# Altium schematic sheet POWER.SchDoc
size A4; SheetNumber: 1; SheetTotal: 2
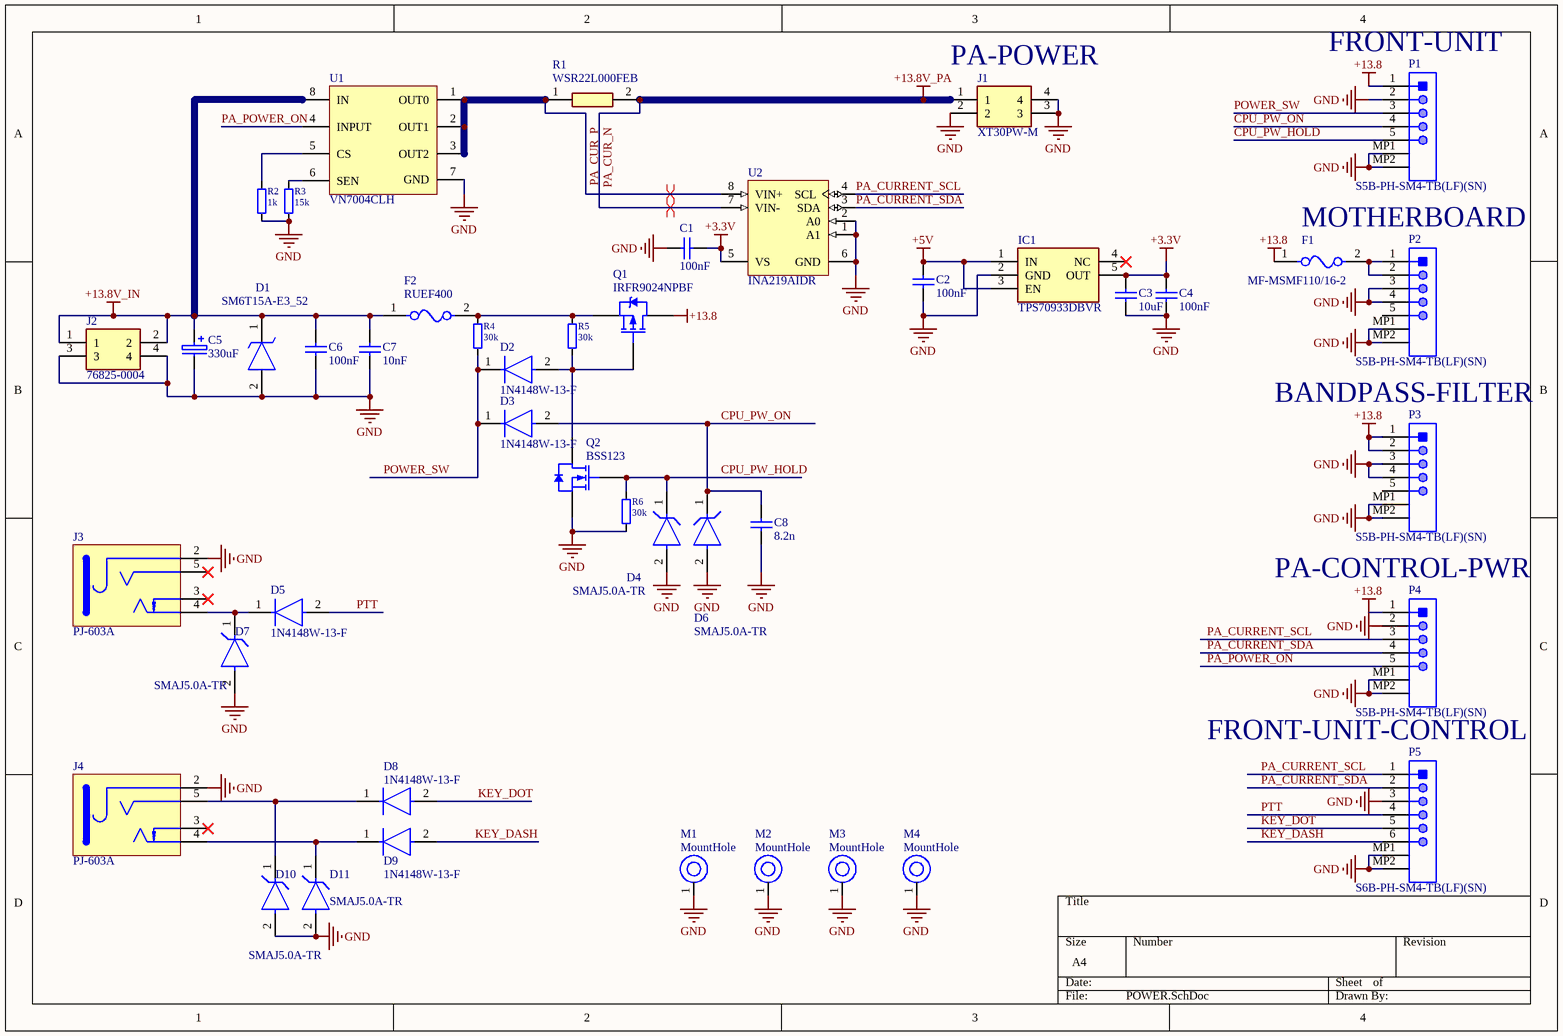
[diagram p0: POWER.SchDoc]

## Parts
C1  100nF  [C-0805]
C2  100nF  [C-0805]
C3  10uF  [C-0805]
C4  100nF  [C-0805]
C5  330uF  [CE 5.0-10x12.5]
C6  100nF  [C-0805]
C7  10nF  [C-0805]
C8  8.2n  [C-0805]
D1  SM6T15A-E3_52  [DIOM5436X244N]
D2  1N4148W-13-F  [FP-SOD123-MFG]
D3  1N4148W-13-F  [FP-SOD123-MFG]
D4  SMAJ5.0A-TR  [FP-SMA-MFG]
D5  1N4148W-13-F  [FP-SOD123-MFG]
D6  SMAJ5.0A-TR  [FP-SMA-MFG]
D7  SMAJ5.0A-TR  [FP-SMA-MFG]
D8  1N4148W-13-F  [FP-SOD123-MFG]
D9  1N4148W-13-F  [FP-SOD123-MFG]
D10  SMAJ5.0A-TR  [FP-SMA-MFG]
D11  SMAJ5.0A-TR  [FP-SMA-MFG]
F1  MF-MSMF110/16-2  [FP-MF-MSMF110-16-MFG]
F2  RUEF400  [FP-RUEF400-MFG]
IC1  TPS70933DBVR  [SOT95P280X145-5N]
J1  XT30PW-M  [XT30PWM]
J2  76825-0004  [768250004]
J3  PJ-603A  [PJ-603A]
J4  PJ-603A  [PJ-603A]
M1  MountHole  [MountHole]
M2  MountHole  [MountHole]
M3  MountHole  [MountHole]
M4  MountHole  [MountHole]
P1  S5B-PH-SM4-TB(LF)(SN)  [JST-S5B-PH-SM4-TB_V]
P2  S5B-PH-SM4-TB(LF)(SN)  [JST-S5B-PH-SM4-TB_V]
P3  S5B-PH-SM4-TB(LF)(SN)  [JST-S5B-PH-SM4-TB_V]
P4  S5B-PH-SM4-TB(LF)(SN)  [JST-S5B-PH-SM4-TB_V]
P5  S6B-PH-SM4-TB(LF)(SN)  [JST-S6B-PH-SM4-TB(LF)(SN)_V]
Q1  IRFR9024NPBF  [ONSC-DPAK-3-369C-01_V]
Q2  BSS123  [FAIR-SOT23-3_V]
R1  WSR22L000FEB  [RESM11670X254N]
R2  1k  [R-0805]
R3  15k  [R-0805]
R4  30k  [R-0805]
R5  30k  [R-0805]
R6  30k  [R-0805]
U1  VN7004CLH  [OctaPAK7_6P1X6P5_STM-M]
U2  INA219AIDR  [D0008A_L]

## Nets
+3.3V: C1.1 C3.1 C4.1 IC1.5(OUT) U2.5(VS)
+5V: C2.1 IC1.1(IN) IC1.3(EN)
+13.8: F1.1 P1.1 P3.1 P3.2 P4.1 Q1.4(D)
+13.8V_IN: C5.1 C6.1 C7.1 D1.1(K) F2.1 J2.1 J2.2 U1.8(IN)
GND: C1.2 C2.2 C3.2 C4.2 C5.2 C6.2 C7.2 C8.2 D1.2(A) D4.2(A) D6.2(A) D7.2(A) D10.2(A) D11.2(A) IC1.2(GND) J1.2 J1.3 J1.4 J2.3 J2.4 J3.2 J4.2 M1.1 M2.1 M3.1 M4.1 P1.2 P1.MP1 P1.MP2 P2.3 P2.4 P2.MP1 P2.MP2 P3.3 P3.4 P3.MP1 P3.MP2 P4.2 P4.MP1 P4.MP2 P5.3 P5.MP1 P5.MP2 Q2.2(S) R2.1 R3.1 R6.1 U1.7(GND) U2.1(A1) U2.2(A0) U2.6(GND)
PA_CUR_N: J1.1 R1.2 U2.7(VIN-)  [also labelled +13.8V_PA]
CPU_PW_HOLD: D4.1(K) P1.5 Q2.1(G) R6.2
CPU_PW_ON: C8.1 D3.2(A) D6.1(K) P1.4
KEY_DASH: D9.2(A) P5.6
KEY_DOT: D8.2(A) P5.5
PA_CUR_P: R1.1 U1.1(OUT0) U1.2(OUT1) U1.3(OUT2) U2.8(VIN+)
PA_CURRENT_SCL: P4.3 P5.1 U2.4(SCL)
PA_CURRENT_SDA: P4.4 P5.2 U2.3(SDA)
PA_POWER_ON: P4.5 U1.4(INPUT)
POWER_SW: D2.1(C) D3.1(C) P1.3 R4.1
PTT: D5.2(A) P5.4
NetD2_2: D2.2(A) Q1.1(G) Q2.3(D) R5.1
NetD5_1: D5.1(C) D7.1(K) J3.4
NetD8_1: D8.1(C) D10.1(K) J4.5
NetD9_1: D9.1(C) D11.1(K) J4.4
NetF1_2: F1.2 P2.1 P2.2
NetF2_2: F2.2 Q1.3(S) R4.2 R5.2
NetR2_2: R2.2 U1.5(CS)
NetR3_2: R3.2 U1.6(SEN)

Not connected (* = marked no-connect by the designer): IC1 4(NC)*; J3 3* 5*; J4 3*; P2 5; P3 5

## Layout directives
differential pair: PA_CUR_N, PA_CUR_P

## Notes on the sheet
- (near J1) PA-POWER
- (near P1) FRONT-UNIT
- MOTHERBOARD
- BANDPASS-FILTER
- PA-CONTROL-PWR
- FRONT-UNIT-CONTROL

## Library data of the parts
C1-C4 C6-C8 = C semi: Ceramic Multilayer Capacitor; Manufacturer: Yageo/Phycomp; Manufacturer P/N: CC0603JRNPO9BN102; numsch: 011; TypeNum: 155; Parameters: 1nF, NP0, 50V, ±5%; Tolerance: ±10%; Voltage: *
C5 = CE: Capacitor Electrolytic; Manufacturer: Yageo/Phycomp; Manufacturer P/N: SK 016 M 470; numsch: 019; TypeNum: 185; Parameters: 470uF, SK, 16V, ±20%; Tolerance: ±20%; Voltage: *; Series: *
D1 = SM6T15A-E3_52: TVS Diode (Uni-directional); Manufacturer_Name: Vishay; Manufacturer_Part_Number: SM6T15A-E3/52; Datasheet Link: https://www.vishay.com/docs/88385/sm6t.pdf; Height: 2.44mm; Mouser Part Number: 625-SM6T15A-E3; Mouser Price/Stock: https://www.mouser.co.uk/ProductDetail/Vishay-General-Semiconductor/SM6T15A-E3-52?qs=nmw3K3MsCZZRtlXmnTWYow%3D%3D; Arrow Part Number: SM6T15A-E3/52; Arrow Price/Stock: https://www.arrow.com/en/products/sm6t15a-e352/vishay?region=nac
D2 D3 D5 D8 D9 = CMP-12791-000005-1: DIODE GEN PURP 100V 150MA SOD123; Manufacturer: Diodes Inc.; Capacitance: 2pF; Forward Current: 300mA; Max Junction Temp: +150°C; Value: 2pF; Standoff Height: 0mm; Peak Reverse Current: 1uA; Max Surge Forward Current: 1A; Category: Diode; Height: 1.45mm; ComponentLink2URL: https://upverter.com/datasheet/628e7d6fee5901eee6eef4567d1c3569f2cd3cde.pdf; Lead Free: Yes; ComponentLink2Description: Datasheet; Octopart: https://octopart.com/1n4148w-13-f-diodes+inc.-2359612; Temperature Range High: +150°C; Device Class L2: Diodes; Digikey Description: DIODE GEN PURP 100V 150MA SOD123; Reverse Voltage: 100V; Temperature Range Low: -65°C; Device Class L1: Discrete Semiconductors; Package: SOD123; RoHS: TRUE; Manufacturer Part Number: 1N4148W-13-F; Footprint Url: https://www.diodes.com/assets/Package-Files/SOD123.pdf; Automotive: No; Max Repetitive Reverse Voltage: 100V; Mouser Description: 1N4148W Series 2 A 100 V 400 mW Surface Mount Fast Switching Diode - SOD-123; Temperature: -65°C to +150°C; Device Class L3: Rectifier Diodes
D4 D6 D7 D10 D11 = CMP-12225-000048-1: TVS DIODE 5V 13.4V SMA; Manufacturer: STMicroelectronics; Standoff Height: 0.05mm; Max Junction Temp: +150°C; Clamping Voltage: 9.2V; Number Of Channels: 1; Peak Pulse Power: 400W; Peak Pulse Current: 43.5A; Breakdown Voltage: 6.4V; Direction: Unidirectional; ComponentLink2Description: Datasheet; Lead Free: Yes; Package: SMA; Height: 2.65mm; Mouser Description: Transient Voltage Suppressor, TVS, Transil SMAJ Series, Unidirectional, 5 V, DO-214AC, 2, 6.4 V; Manufacturer Part Number: SMAJ5.0A-TR; Reverse Standoff Voltage: 5V; Temperature Range Low: -55°C; Device Class L1: Circuit Protection; RoHS: TRUE; Category: Diode; Automotive: No; ComponentLink2URL: https://www.st.com/resource/en/datasheet/smaj.pdf; Device Class L3: unset; Device Class L2: TVS Diodes; Temperature Range High: +150°C; Octopart: https://octopart.com/smaj5.0a-tr-stmicroelectronics-347063; Digikey Description: TVS DIODE 5V 13.4V SMA; Temperature: -55°C to +150°C
F1 = CMP-07400-000018-1: PTC RESET FUSE 16V 1.1A 1812; Manufacturer: Bourns; Automotive Grade: Grade 3; Trip Current: 2.2A; Trip Time: 0.3s; Value: 0.04-0.21Ω; Current Rating: 100A; Category: Fuse; ComponentLink2Description: Datasheet; Temperature: -40°C to +85°C; Octopart: https://octopart.com/mf-msmf110%2F16-2-bourns-40767; Ambient Temperature Range Low: -40°C; Manufacturer Part Number: MF-MSMF110/16-2; Device Class L3: unset; RoHS: TRUE; Device Class L2: PTC Resettable Fuses; Package: MF-MSMF110/16; Digikey Description: PTC RESET FUSE 16V 1.1A 1812; Height: 0.85mm; Mouser Description: Resettable Fuses - PPTC 1.1A 16V 0.04ohm; Lead Free: Yes; Automotive: Yes; Hold Current: 1.1A; Resistance: 0.04-0.21Ω; Temperature Range Low: -40°C; Device Class L1: Circuit Protection; Ambient Temperature Range High: +85°C; Voltage Rating: 16V; ComponentLink2URL: https://upverter.com/datasheet/72639194a1e73201de7e7957ee4193eb5a54a50e.pdf; Temperature Range High: +85°C
F2 = CMP-08606-000051-1: PTC RESET FUSE 30V 4A RADIAL; Manufacturer: Littelfuse; Current Rating: 100A; Resistance: 0.01-0.05Ω; Trip Time: 12.7s; Trip Current: 8A; Value: 0.01-0.05Ω; Hold Current: 4A; Ambient Temperature Range Low: -40°C; Temperature Range Low: -40°C; Temperature Range High: +85°C; Lead Free: Yes; ComponentLink2URL: https://www.littelfuse.com/~/media/electronics/datasheets/resettable_ptcs/littelfuse_ptc_radial_leaded_ruef_datasheet.pdf.pdf; Temperature: -40°C to +85°C; Device Class L1: Circuit Protection; Voltage Rating: 30V; Ambient Temperature Range High: +85°C; Digikey Description: PTC RESET FUSE 30V 4A RADIAL; RoHS: TRUE; Automotive: No; Category: Fuse; Mouser Description: PTC Resettable Fuse 4A(hold) 8A(trip) 30V 100A 2.5W 12.7s 0.01Ohm Radial 14 X 3 X 19.3mm Bag; Device Class L2: PTC Resettable Fuses; Package: RUEF400; Height: 19.3mm; Device Class L3: unset; ComponentLink2Description: Datasheet; Octopart: https://octopart.com/ruef400-littelfuse-74215791; Manufacturer Part Number: RUEF400
IC1 = TPS70933DBVR: Integrated Circuit; Manufacturer_Name: Texas Instruments; Datasheet Link: http://www.ti.com/lit/gpn/tps709; Height: 1.45mm; Manufacturer_Part_Number: TPS70933DBVR; Mouser Part Number: 595-TPS70933DBVR; Mouser Price/Stock: https://www.mouser.co.uk/ProductDetail/Texas-Instruments/TPS70933DBVR?qs=Z9twEOuL%252B%2FJOaGO60BtvLA%3D%3D; Arrow Part Number: TPS70933DBVR; Arrow Price/Stock: https://www.arrow.com/en/products/tps70933dbvr/texas-instruments?region=nac
J1 = XT30PW-M: Connector; Manufacturer_Name: Amass; Datasheet Link: https://www.tme.eu/sl/Document/ce4077e36b79046da520ca73227e15de/XT30PW%20SPEC.pdf; Height: 5mm; Manufacturer_Part_Number: XT30PW-M
J2 = 76825-0004: Connector; Manufacturer_Name: Molex; Datasheet Link: https://componentsearchengine.com//76825-0004.pdf; Height: 16mm; Mouser2 Part Number: 538-76825-0004; Mouser2 Price/Stock: https://www.mouser.com/Search/Refine.aspx?Keyword=538-76825-0004; Manufacturer_Part_Number: 76825-0004
P1-P4 = CMP-2000-07026-1: Male Header, Pitch 2 mm, 1 x 5 Position, Height 5.5 mm, -25 to 85 degC, RoHS, Tape and Reel; Manufacturer: JST; No of Positions: 5; Pitch: 2mm; Style/Orientation: RightAngleHeader/Plug; Manufacturer URL: http://www.jst.com/home2.html; Datasheet URL: http://www.jst-mfg.com/product/pdf/eng/ePH.pdf; Termination: Crimp; Mounting Technology: SurfaceMount; Package Reference: S5B-PH-SM4-TB; Type: WiretoBoard; Datasheet Version: 12/2012; Package Description: Male Header, Pitch 2 mm, 1 x 5 Position, Height 5.5 mm
P5 = CMP-2000-07027-1: Male Header, Pitch 2 mm, 1 x 6 Position, Height 5.5 mm, -25 to 85 degC; Manufacturer: JST; Pitch: 2mm; Style/Orientation: RightAngleHeader/Plug; No of Positions: 6; Package Reference: S6B-PH-SM4-TB(LF)(SN); Type: ShroudedHeader; Package Description: Male Header, Pitch 2 mm, 1 x 6 Position, Height 5.5 mm; Mounting Technology: SurfaceMount; Datasheet Version: 11/2008; Termination: Solder; Datasheet URL: https://datasheet.ciiva.com/11747/0900766b80df0d9d-11747278.pdf; Manufacturer URL: http://www.jst.com/home2.html
Q1 = CMP-1058-00387-1: IRFR9024NPBF, Транзистор, Р-канал 55В 11А; Manufacturer: On Semiconductor; PartNumber: NTD2955G; Ciss Typ (pF): 500; Qrr Typ (nC): 100; VGS Max (V): 20; PD Max (W): 55; Channel Polarity: P Channel; V(BR)DSS Min (V): 60; ID Max (A): 12; Configuration: Single; Crss Typ (pF): 50; Packing: Tape and Reel; VGS(th) Max (V): 4; Coss Typ (pF): 150; RoHS: Pb-Free; ComponentLink1Description: Manufacturer URL; Mounting Technology: Surface Mount; ComponentLink2URL: http://www.onsemi.cn/pub_link/Collateral/NTD2955-D.PDF; PackageDescription: 3-Pin Flange Mount, Body 6.54 x 6.095 mm, Pitch 2.29 mm; ComponentLink3Description: Package Specification; Package Type: DPAK-3, IPAK-4; ComponentLink3URL: http://www.onsemi.cn/pub_link/Collateral/369C.PDF; DatasheetVersion: Rev. 13; ComponentLink2Description: Datasheet; ComponentLink1URL: http://www.onsemi.com/; PackageVersion: Rev. E, 02/2014; PackageReference: DPAK-3-369C-01
Q2 = CMP-2000-04934-1: N-Channel Logic Level Enhancement Mode Field Effect Transistor, 1.7 V, -55 to 150 degC, 3-Pin SOT-23, RoHS, Tape and Reel; Manufacturer: Fairchild; Channel Type: N; Typical Turn-Off Delay Time: 17ns; Maximum Continuous Drain Current: 0.17A; Rad Hard: No; Typical Rise Time: 9ns; Typical Fall Time: 2.4ns; Maximum Gate Source Voltage: ±20V; Maximum Drain Source Voltage: 100V; Typical Turn-On Delay Time: 1.7ns; RDS-on: 6000@10VmOhm; Package Version: Rev. 12, 03/2016; Packaging: Tape&Reel; Package Reference: SOT23-3; Channel Mode: Enhancement; Operating Temperature: -55to150degC; Package Description: 3-Pin Small Outline Transistor, Body 2.92 x 1.325 mm, Pitch 0.95 mm; Category: MOSFET; Datasheet Version: Jun-03; Datasheet URL: https://www.fairchildsemi.com/datasheets/BS/BSS123.pdf; Manufacturer URL: https://www.fairchildsemi.com/; Mounting: SurfaceMount; Package: 3SOT-23; Package URL: http://www.fairchildsemi.com/dwg/MA/MA03D.pdf
R1 = WSR21L000FEA: Resistor; Manufacturer_Name: Vishay; Datasheet Link: https://componentsearchengine.com/Datasheets/1/WSR21L000FEA.pdf; Height: 2.537mm; Manufacturer_Part_Number: WSR21L000FEA; Mouser Part Number: 71-WSR21L000FEA; Mouser Price/Stock: https://www.mouser.com/Search/Refine.aspx?Keyword=71-WSR21L000FEA; Arrow Part Number: WSR21L000FEA; Arrow Price/Stock: https://www.arrow.com/en/products/wsr21l000fea/vishay
R2-R6 = RES semi: Chip Resistor; Manufacturer: Yageo/Phycomp; Manufacturer P/N: RC0603FR-0749R9L; numsch: 021; TypeNum: 212; Parameters: 49.9R, RC, 0.1W, ±1%, TCR ±100ppm; Power: *; TCR: *; Series: *; Tolerance: *
U2 = CMP-0704-00003-2: Zero-Drift, Bi-Directional Current / Power Monitor, 3 to 5.5 V, -40 to 125 degC, 8-pin SOIC (D8), Green (RoHS & no Sb/Br); Manufacturer: Texas Instruments; Common Mode Range(Min)(V): 0; SubFamily: Current Shunt Monitor; Rating: Catalog; Input Offset (+/-)(Max)(uV): 100; Vs(Max)(V): 5.5; Common Mode Range(Max)(V): 26; Quiescent Current (+/-)(Typ)(mA): 0.7; Vs(Min)(V): 3; Gain(V/V): 1, 0.5, 0.25, 0.125; Small-Signal Bandwidth(Typ)(MHz): 0.011; PackageReference: D0008A; ComponentLink1URL: http://www.ti.com/; Eco-Plan: Green (RoHS & no Sb/Br); ComponentLink2URL: http://www.ti.com/general/docs/lit/getliterature.tsp?genericPartNumber=INA219&fileType=pdf; ComponentLink1Description: Manufacturer URL; ComponentLink3Description: Package Specification; Mounting Technology: Surface Mount; PackageDescription: 8-Pin Plastic Small Outline, Body 4.9 x 3.9 mm, Pitch 1.27 mm; ComponentLink3URL: http://www.ti.com/lit/ml/msoi002j/msoi002j.pdf; DatasheetVersion: SBOS448F; PackageVersion: 4040047-3/M, 06/2011; PartNumber: INA219AIDR; Code_JEDEC: MS-012; ComponentLink2Description: Datasheet; CMRR(Min)(dB): 100